# Altium schematic sheet sd.SchDoc
size A
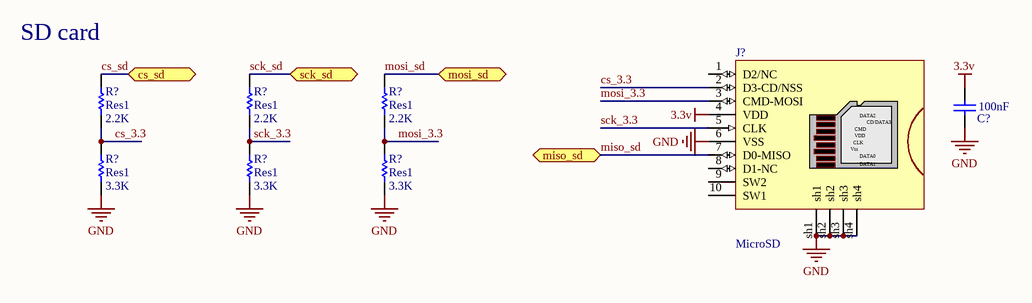
[diagram p0: sd.SchDoc]

## Parts
(Parts that share a designator on the sheet are numbered #1, #2 ... from top to bottom, then left to right.)
C?  value 100nF  [CAP 1206 (3216X15L)]  (hidden comment: Cap)
J?  MicroSD  [SD_card]
R?#1  Res1  value 2.2K  [RES 1206 (3216X08L)]
R?#2  Res1  value 2.2K  [RES 1206 (3216X08L)]
R?#3  Res1  value 2.2K  [RES 1206 (3216X08L)]
R?#4  Res1  value 3.3K  [RES 1206 (3216X08L)]
R?#5  Res1  value 3.3K  [RES 1206 (3216X08L)]
R?#6  Res1  value 3.3K  [RES 1206 (3216X08L)]

## Ports
cs_sd (bidir), miso_sd (bidir), mosi_sd (bidir), sck_sd (bidir)

## Nets
3.3v: C?.2 J?.4(VDD)
GND: C?.1 J?.6(VSS) J?.sh1 J?.sh2 J?.sh3 J?.sh4 R?#4.1 R?#5.1 R?#6.1
cs_3.3: J?.2(D3-CD/NSS) R?#1.1 R?#4.2
cs_sd: R?#1.2 ; port cs_sd
miso_sd: J?.7(D0-MISO) ; port miso_sd
mosi_3.3: J?.3(CMD-MOSI) R?#3.1 R?#6.2
mosi_sd: R?#3.2 ; port mosi_sd
sck_3.3: J?.5(CLK) R?#2.1 R?#5.2
sck_sd: R?#2.2 ; port sck_sd

Not connected (* = marked no-connect by the designer): J? 1(D2/NC) 8(D1-NC) 9(SW2) 10(SW1)

## Notes on the sheet
- (near R?#1) SD card
- (in symbol MicroSD) DATA2; CD/DATA3; CMD; Vss; DATA0; DATA1

## Library data of the parts
C? = Cap ceramic: CAP-100Nf
J? = MicroSD: MicroSD_altium designer (M.Hariri); Created by:: altium designer (M.Hariri); VALUE: MicroSD
R?#1-R?#6 = Res1: Resistor; Published: 8-Jun-2000; LatestRevisionDate: 17-Jul-2002; LatestRevisionNote: Re-released for DXP Platform.; PackageReference: AXIAL-0.3; Publisher: Altium Limited; PackageDescription: Axial Device, Thru-Hole; 2 Leads; 0.3 in Pin Spacing